# Altium schematic sheet Laser_Harp_Top.SchDoc
size Letter
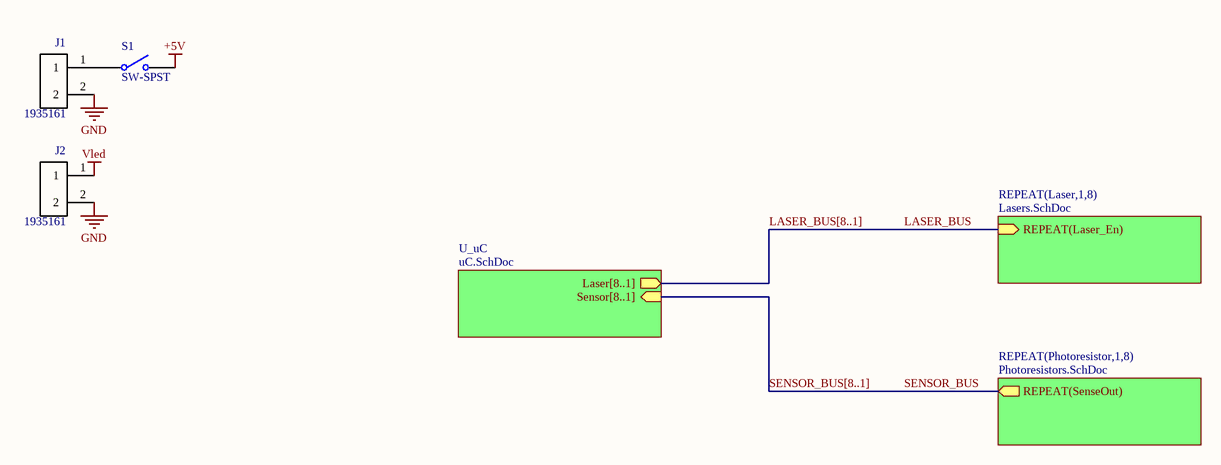
[diagram p0: Laser_Harp_Top.SchDoc]

## Parts
J1  1935161  [PHOENIX_1935161]
J2  1935161  [PHOENIX_1935161]
S1  SW-SPST  [SPST-2]

## Sub-sheets
REPEAT(Laser,1,8) = Lasers.SchDoc: REPEAT(Laser_En) (in)
REPEAT(Photoresistor,1,8) = Photoresistors.SchDoc: REPEAT(SenseOut) (out)
U_uC = uC.SchDoc: Laser[8..1] (out), Sensor[8..1] (in)

## Nets
+5V: S1.2(NO)
GND: J1.2 J2.2
Vled: J2.1
LASER_BUS: sheet REPEAT(Laser,1,8)/REPEAT(Laser_En)
SENSOR_BUS: sheet REPEAT(Photoresistor,1,8)/REPEAT(SenseOut)
NetJ1_1: J1.1 S1.1(COMMON)

## Buses and harness runs
bus LASER_BUS[8..1] = sheet U_uC/Laser[8..1]
bus SENSOR_BUS[8..1] = sheet U_uC/Sensor[8..1]

## Notes on the sheet
- Title
- Size:
- Date:
- Letter
- Number:
- Time:
- Revision:
- Sheet
- of
- File:

## Library data of the parts
J1 J2 = 1935161: Conn Terminal Blocks 2 POS 5mm Solder ST Thru-Hole 16A; MF: Phoenix Contact; Digi-Key_Part_Number: 277-1667-ND; Package: None; SnapEDA_Link: https://www.snapeda.com/parts/1935161/Phoenix%20Contact/view-part/?ref=snap; MP: 1935161; Digi-Key_Purchase_URL: https://www.digikey.com/product-detail/en/phoenix-contact/1935161/277-1667-ND/568614?utm_source=snapeda&utm_medium=aggregator&utm_campaign=symbol; Value: *
S1 = SW-SPST: Single-Pole, Single-Throw Switch; Published: 24-Mar-1999; LatestRevisionDate: 17-Jul-2002; LatestRevisionNote: Re-released for DXP Platform.; PackageReference: SPST-2; Publisher: Altium Limited